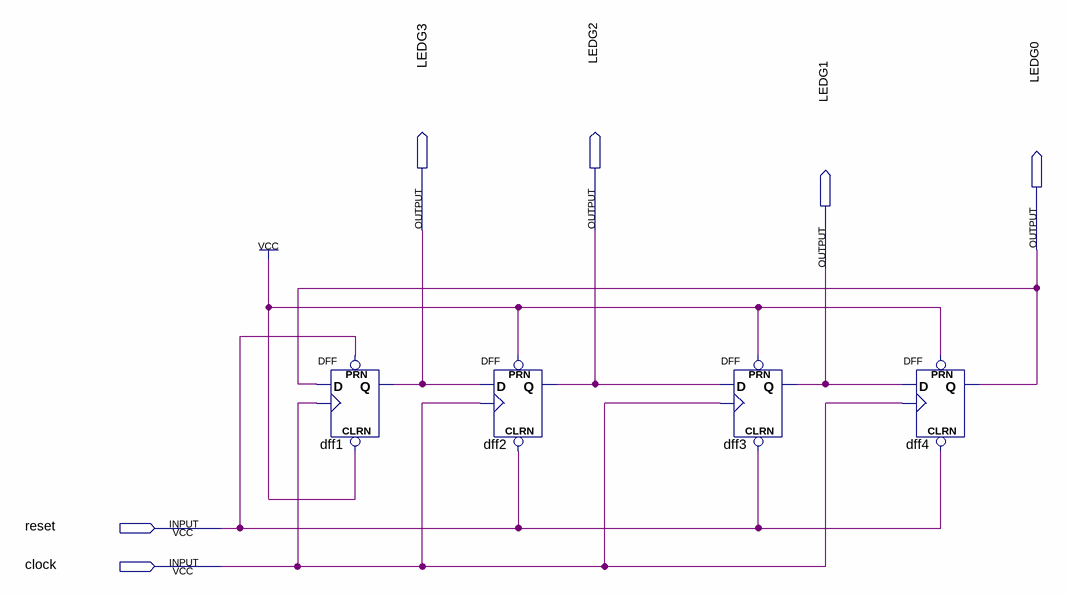
[diagram p0: schematic sheet]
// Quartus schematic Shift_Reg_DFF.bdf as structural Verilog: 4 symbols, 6 pins
module Shift_Reg_DFF (
  input  reset,
  input  clock,
  output LEDG3,
  output LEDG2,
  output LEDG0,
  output LEDG1
);

  DFF dff1 (.CLRN(1'b1), .CLK(clock), .D(LEDG0), .PRN(reset), .Q(LEDG3));
  DFF dff2 (.CLRN(reset), .CLK(clock), .D(LEDG3), .PRN(1'b1), .Q(LEDG2));
  DFF dff3 (.CLRN(reset), .CLK(clock), .D(LEDG2), .PRN(1'b1), .Q(LEDG1));
  DFF dff4 (.CLRN(reset), .CLK(clock), .D(LEDG1), .PRN(1'b1), .Q(LEDG0));
endmodule
